# Altium schematic sheet POTS.SchDoc
size A4
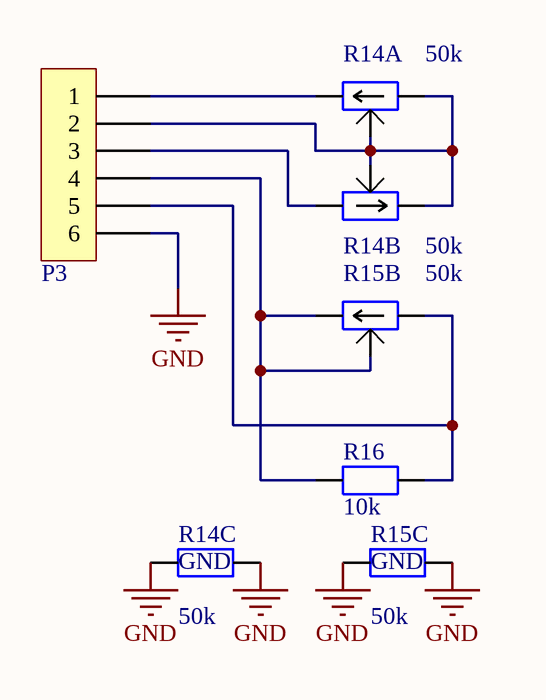
[diagram p0: POTS.SchDoc]

## Parts
P3  SIL-CONN-6  [SIL-CONN-6-R1]  (value not drawn)
R14  value 50k  [RK09L12B0A31]  (hidden comment: RK09L12B0A31)  (parts A,B,C of 3)
R15  value 50k  [RK09L12B0A31]  (hidden comment: RK09L12B0A31)  (parts B,C of 3)
R16  value 10k  [0805_Resistor]  (hidden comment: Resistor)

## Nets
GND: P3.6 R14.7 R14.8 R15.7 R15.8
NetP3_1: P3.1 R14.3
NetP3_2: P3.2 R14.1 R14.2 R14.5 R14.6
NetP3_3: P3.3 R14.4
NetP3_4: P3.4 R15.5 R15.6 R16.1
NetP3_5: P3.5 R15.4 R16.2

## Notes on the sheet
- (in symbol RK09L12B0A31, part C) GND